# Altium schematic sheet Sheet_Connector.SchDoc: =ProjectName
size A4; CheckedBy: DatNB; Author: Ven; CompanyName: Nacentech; Organization: IMET
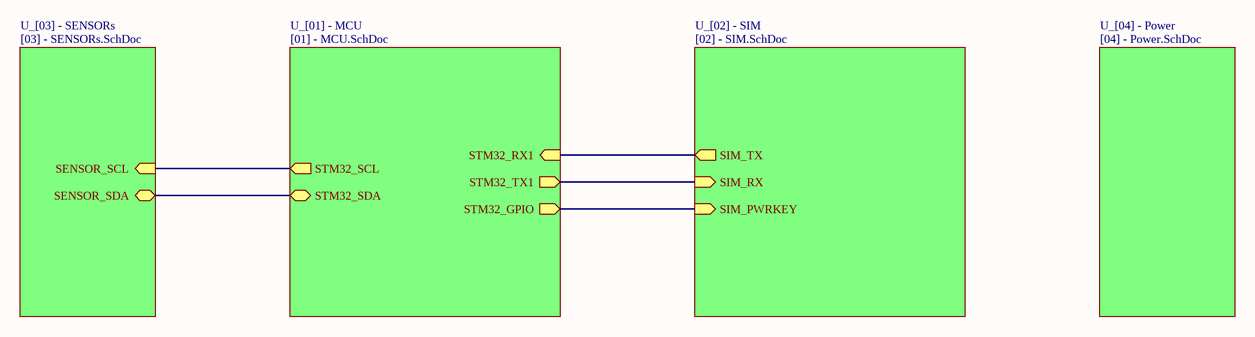
[diagram p0: Sheet_Connector.SchDoc]

## Sub-sheets
U_[01] - MCU = [01] - MCU.SchDoc: STM32_TX1 (out), STM32_RX1 (in), STM32_SCL (out), STM32_SDA (bidir), STM32_GPIO (out)
U_[02] - SIM = [02] - SIM.SchDoc: SIM_TX (out), SIM_RX (in), SIM_PWRKEY (in)
U_[03] - SENSORs = [03] - SENSORs.SchDoc: SENSOR_SCL (in), SENSOR_SDA (bidir)
U_[04] - Power = [04] - Power.SchDoc: no entries

## Nets
(unnamed): sheet U_[01] - MCU/STM32_TX1, sheet U_[02] - SIM/SIM_RX
(unnamed): sheet U_[01] - MCU/STM32_RX1, sheet U_[02] - SIM/SIM_TX
(unnamed): sheet U_[01] - MCU/STM32_SCL, sheet U_[03] - SENSORs/SENSOR_SCL
(unnamed): sheet U_[01] - MCU/STM32_SDA, sheet U_[03] - SENSORs/SENSOR_SDA
(unnamed): sheet U_[01] - MCU/STM32_GPIO, sheet U_[02] - SIM/SIM_PWRKEY

## Notes on the sheet
- Project:
- Page Contents:
- Size:
- Date:
- A4
- Checked by:
- Time:
- Revision:
- Sheet
- of
- File: